# EAGLE design PCB (EAGLE 9.6.2)
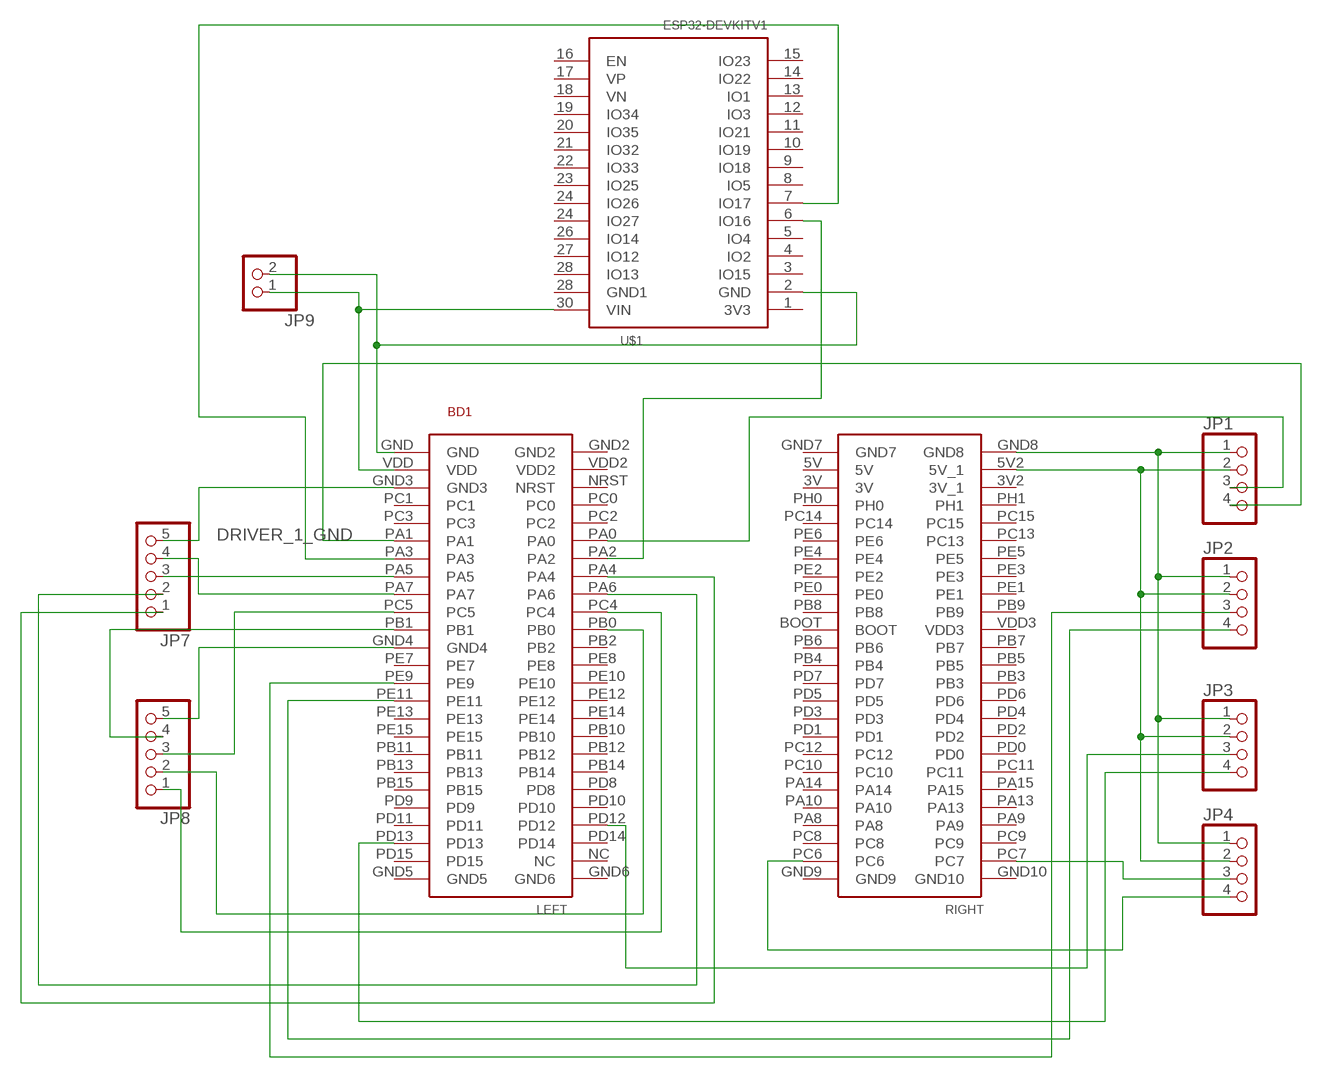
[diagram p0: schematic, sheet 1]

## Parts
BD1  STM32F4-DISCOVERY  [STM32F407VG]
JP1  PINHD-1X4  [1X04]
JP2  PINHD-1X4  [1X04]
JP3  PINHD-1X4  [1X04]
JP4  PINHD-1X4  [1X04]
JP7  PINHD-1X5  [1X05]
JP8  PINHD-1X5  [1X05]
JP9  PINHD-1X2  [1X02]
U$1  ESP32DEVKITV1  [ESP32-DEVKITV1]

## Nets
DRIVER_1_GND: BD1.GND3 JP7.5
N$1: BD1.VDD JP9.1 U$1.30(VIN)
N$2: BD1.GND JP9.2 U$1.2(GND)
N$3: BD1.GND4 JP8.5
N$4: BD1.PA7 JP7.4
N$5: BD1.PA5 JP7.3
N$6: BD1.PA6 JP7.2
N$7: BD1.PA4 JP7.1
N$8: BD1.PB1 JP8.4
N$9: BD1.PC5 JP8.3
N$10: BD1.PB0 JP8.2
N$11: BD1.PC4 JP8.1
N$12: BD1.PA2 U$1.6(IO16)
N$13: BD1.PA3 U$1.7(IO17)
N$14: BD1.GND8 JP1.1 JP2.1 JP3.1 JP4.1
N$15: BD1.5V2(5V_1) JP1.2 JP2.2 JP3.2 JP4.2
N$16: BD1.PA1 JP1.4
N$17: BD1.PA0 JP1.3
N$18: BD1.PE9 JP2.3
N$19: BD1.PE11 JP2.4
N$20: BD1.PD12 JP3.3
N$21: BD1.PD13 JP3.4
N$22: BD1.PC7 JP4.3
N$23: BD1.PC6 JP4.4
Unconnected: BD1.3V BD1.3V2(3V_1) BD1.5V BD1.BOOT BD1.GND2 BD1.GND5 BD1.GND6 BD1.GND7 BD1.GND9 BD1.GND10 BD1.NC BD1.NRST BD1.PA8 BD1.PA9 BD1.PA10 BD1.PA13 BD1.PA14 BD1.PA15 BD1.PB2 BD1.PB3 BD1.PB4 BD1.PB5 BD1.PB6 BD1.PB7 BD1.PB8 BD1.PB9 BD1.PB10 BD1.PB11 BD1.PB12 BD1.PB13 BD1.PB14 BD1.PB15 BD1.PC0 BD1.PC1 BD1.PC2 BD1.PC3 BD1.PC8 BD1.PC9 BD1.PC10 BD1.PC11 BD1.PC12 BD1.PC13 BD1.PC14 BD1.PC15 BD1.PD0 BD1.PD1 BD1.PD2 BD1.PD3 BD1.PD4 BD1.PD5 BD1.PD6 BD1.PD7 BD1.PD8 BD1.PD9 BD1.PD10 BD1.PD11 BD1.PD14 BD1.PD15 BD1.PE0 BD1.PE1 BD1.PE2 BD1.PE3 BD1.PE4 BD1.PE5 BD1.PE6 BD1.PE7 BD1.PE8 BD1.PE10 BD1.PE12 BD1.PE13 BD1.PE14 BD1.PE15 BD1.PH0 BD1.PH1 BD1.VDD2 BD1.VDD3 U$1.1(3V3) U$1.3(IO15) U$1.4(IO2) U$1.5(IO4) U$1.8(IO5) U$1.9(IO18) U$1.10(IO19) U$1.11(IO21) U$1.12(IO3) U$1.13(IO1) U$1.14(IO22) U$1.15(IO23) U$1.16(EN) U$1.17(VP) U$1.18(VN) U$1.19(IO34) U$1.20(IO35) U$1.21(IO32) U$1.22(IO33) U$1.23(IO25) U$1.24(IO26) U$1.24(IO27) U$1.26(IO14) U$1.27(IO12) U$1.28(GND1) U$1.28(IO13)

## Library data of the parts
BD1 = STM32F4 DISCOVERY:STM32F4-DISCOVERY: STM32F4DISCOVERY STM32F407VG Create by Jairo Reyes Email: jairo.314@hotmail.com
JP1-JP4 = pinhead:PINHD-1X4: PIN HEADER
JP7 JP8 = pinhead:PINHD-1X5: PIN HEADER
JP9 = pinhead:PINHD-1X2: PIN HEADER
U$1 = ESP32-DEVKITV1:ESP32DEVKITV1

## Board
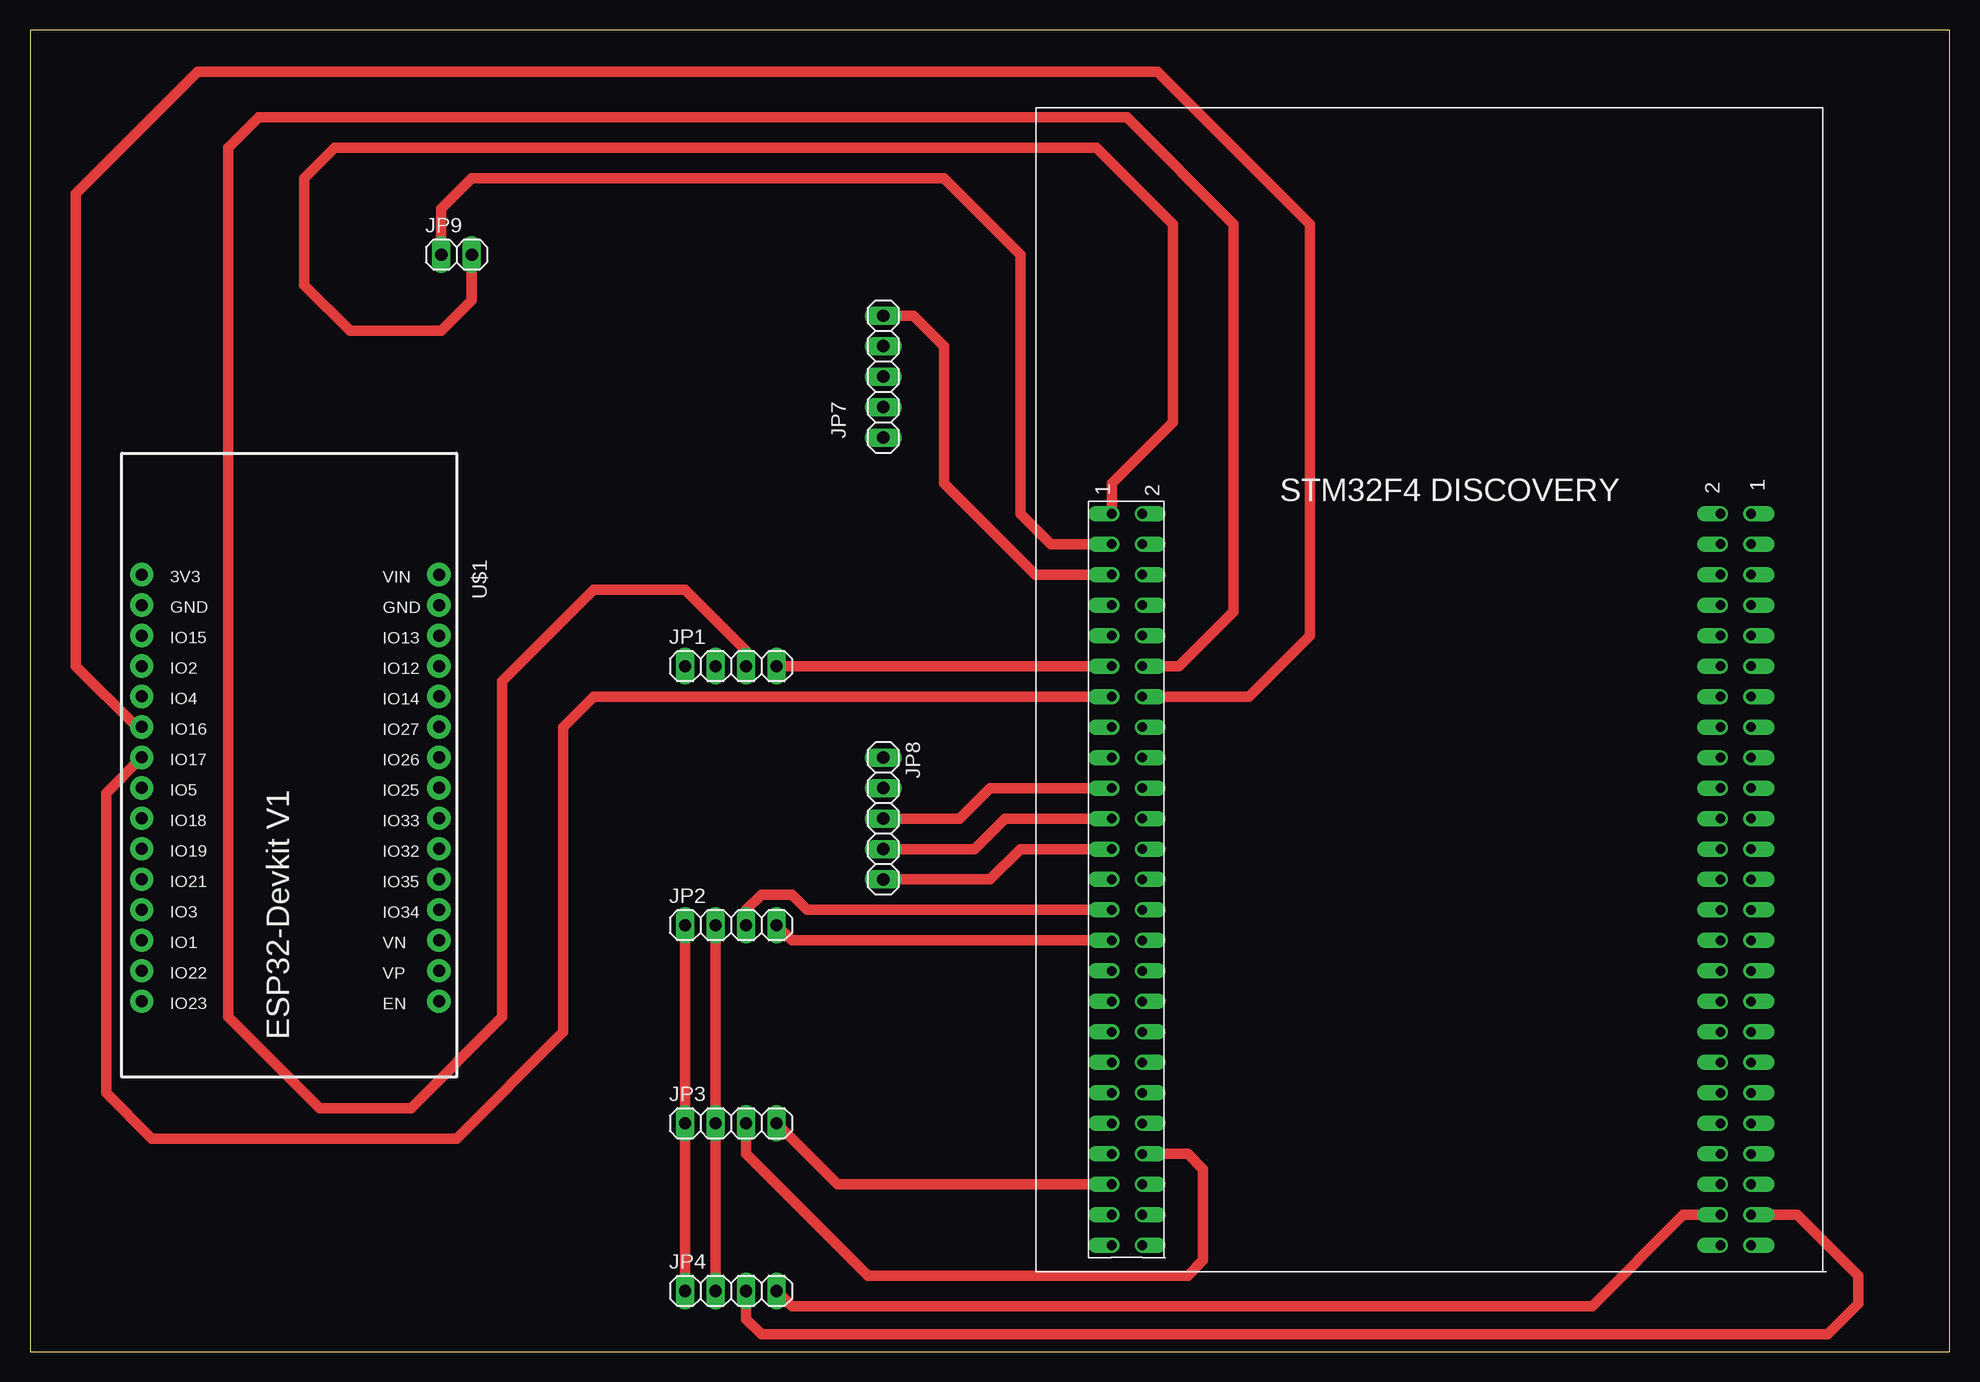
[diagram p1: board, top side]
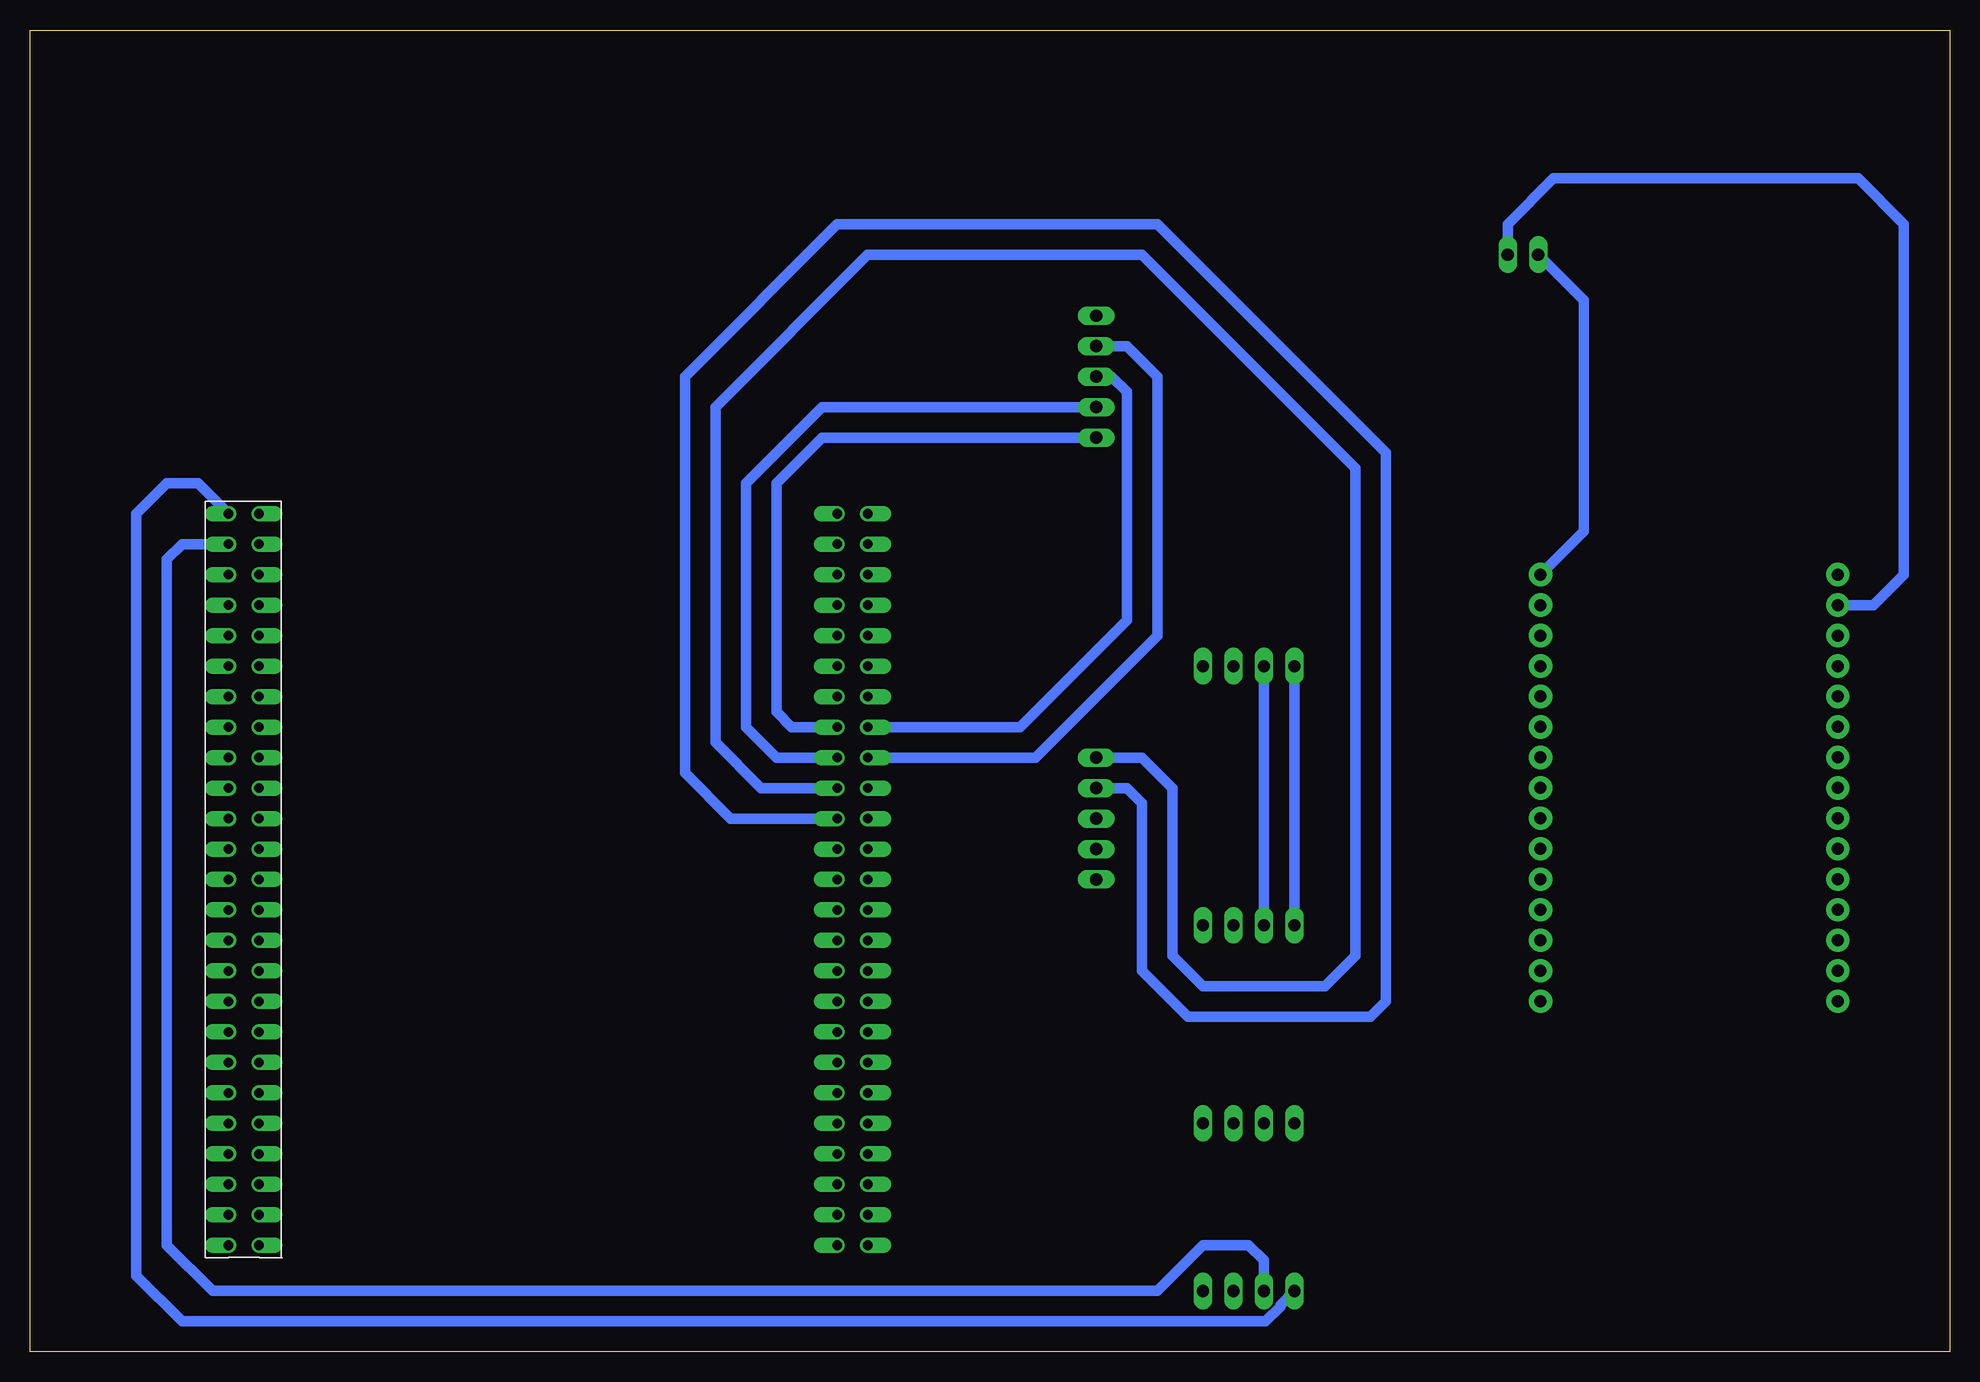
[diagram p2: board, bottom side, seen from below]

Size 160 x 110.16 mm. Coordinates in mm from the lower left corner, seen from the top.
Outline: 0,0 160,0 160,110.16 0,110.16 0,0
Copper layers (1*16): Top 0.035mm / dielectric 1.5mm / Bottom 0.035mm
Design rules "default": minimum track width 6mil, minimum drill 0.35mm, track to track 6mil, track to pad 6mil, pad to pad 6mil, via to via 6mil, smd to smd 6mil, copper to edge 40mil, drill to drill 6mil, minimum pad ring 10mil, minimum via ring 8mil, stop-mask expansion 4mil, vias tented up to drill 0mil, thermal gap 10mil

### Footprints (pad centres in the part's own frame; a part is rotated, then mirrored left to right if it is on the bottom)
STM32F407VG = drill 0.8 pad 1.27 offset: 3V 50.74,55.88; 3V2 53.28,55.88; 5V 50.74,58.42; 5V2 53.28,58.42; BOOT 50.74,35.56; GND 0,60.96; GND2 2.54,60.96; GND3 0,55.88; GND4 0,33.02; GND5 0,0; GND6 2.54,0; GND7 50.74,60.96; GND8 53.28,60.96; GND9 50.74,0; GND10 53.28,0; NC 2.54,2.54; NRST 2.54,55.88; PA0 2.54,48.26; PA1 0,48.26; PA2 2.54,45.72; PA3 0,45.72; PA4 2.54,43.18; PA5 0,43.18; PA6 2.54,40.64; PA7 0,40.64; PA8 50.74,7.62; PA9 53.28,7.62; PA10 50.74,10.16; PA13 53.28,10.16; PA14 50.74,12.7; PA15 53.28,12.7; PB0 2.54,35.56; PB1 0,35.56; PB2 2.54,33.02; PB3 53.28,27.94; PB4 50.74,30.48; PB5 53.28,30.48; PB6 50.74,33.02; PB7 53.28,33.02; PB8 50.74,38.1; PB9 53.28,38.1; PB10 2.54,20.32; PB11 0,17.78; PB12 2.54,17.78; PB13 0,15.24; PB14 2.54,15.24; PB15 0,12.7; PC0 2.54,53.34; PC1 0,53.34; PC2 2.54,50.8; PC3 0,50.8; PC4 2.54,38.1; PC5 0,38.1; PC6 50.74,2.54; PC7 53.28,2.54; PC8 50.74,5.08; PC9 53.28,5.08; PC10 50.74,15.24; PC11 53.28,15.24; PC12 50.74,17.78; PC13 53.28,48.26; PC14 50.74,50.8; PC15 53.28,50.8; PD0 53.28,17.78; PD1 50.74,20.32; PD2 53.28,20.32; PD3 50.74,22.86; PD4 53.28,22.86; PD5 50.74,25.4; PD6 53.28,25.4; PD7 50.74,27.94; PD8 2.54,12.7; PD9 0,10.16; PD10 2.54,10.16; PD11 0,7.62; PD12 2.54,7.62; PD13 0,5.08; PD14 2.54,5.08; PD15 0,2.54; PE0 50.74,40.64; PE1 53.28,40.64; PE2 50.74,43.18; PE3 53.28,43.18; PE4 50.74,45.72; PE5 53.28,45.72; PE6 50.74,48.26; PE7 0,30.48; PE8 2.54,30.48; PE9 0,27.94; PE10 2.54,27.94; PE11 0,25.4; PE12 2.54,25.4; PE13 0,22.86; PE14 2.54,22.86; PE15 0,20.32; PH0 50.74,53.34; PH1 53.28,53.34; VDD 0,58.42; VDD2 2.54,58.42; VDD3 53.28,35.56
1X04 = drill 1.016 long: 1 -3.81,0; 2 -1.27,0; 3 1.27,0; 4 3.81,0
1X05 = drill 1.016 long: 1 -5.08,0; 2 -2.54,0; 3 0,0; 4 2.54,0; 5 5.08,0
1X02 = drill 1.016 long: 1 -1.27,0; 2 1.27,0
ESP32-DEVKITV1 = drill 1 pad 1.93: 1 -22.87,-13.54; 2 -20.33,-13.54; 3 -17.79,-13.54; 4 -15.25,-13.54; 5 -12.71,-13.54; 6 -10.17,-13.54; 7 -7.63,-13.54; 8 -5.09,-13.54; 9 -2.55,-13.54; 10 -0.01,-13.54; 11 2.53,-13.54; 12 5.07,-13.54; 13 7.61,-13.54; 14 10.15,-13.54; 15 12.69,-13.54; 16 12.69,11.23; 17 10.15,11.23; 18 7.61,11.23; 19 5.07,11.23; 20 2.53,11.23; 21 -0.01,11.23; 22 -2.55,11.23; 23 -5.09,11.23; 24 -7.63,11.23; 25 -10.17,11.23; 26 -12.71,11.23; 27 -15.25,11.23; 28 -17.79,11.23; 29 -20.33,11.23; 30 -22.87,11.23

### Placement (x,y rotation side)
BD1  90.17,8.89 0 top
JP1  58.42,57.15 0 top
JP2  58.42,35.56 0 top
JP3  58.42,19.05 0 top
JP4  58.42,5.08 0 top
JP7  71.12,81.28 90 top
JP8  71.12,44.45 270 top
JP9  35.56,91.44 0 top
U$1  22.86,41.91 270 top

### Tracks (layer width: path | path; a pad name or v marks a point on that pad's centre or on a via)
DRIVER_1_GND
  Top 0.889: BD1.GND3 83.82,64.77 76.2,72.39 76.2,83.82 73.66,86.36 JP7.5
N$1
  Top 0.889: BD1.VDD 85.09,67.31 82.55,69.85 82.55,91.44 76.2,97.79 36.83,97.79 34.29,95.25 JP9.1
  Bottom 0.889: JP9.1 30.48,87.63 30.48,68.39 U$1.30
N$2
  Top 0.889: BD1.GND 90.17,72.39 95.25,77.47 95.25,93.98 88.9,100.33 25.4,100.33 22.86,97.79 22.86,88.9 26.67,85.09 34.29,85.09 36.83,87.63 JP9.2
  Bottom 0.889: JP9.2 36.83,93.98 33.02,97.79 7.62,97.79 3.81,93.98 3.81,64.77 6.34,62.24 U$1.2
N$3
  Top 0.889: JP8.5 80.01,39.37 82.55,41.91 BD1.GND4
N$4
  Bottom 0.889: BD1.PA7 76.2,49.53 66.04,59.69 66.04,81.28 68.58,83.82 JP7.4
N$5
  Bottom 0.889: BD1.PA5 77.47,52.07 68.58,60.96 68.58,80.01 69.85,81.28 JP7.3
N$6
  Bottom 0.889: BD1.PA6 97.79,49.53 100.33,52.07 100.33,72.39 93.98,78.74 JP7.2
N$7
  Bottom 0.889: BD1.PA4 96.52,52.07 97.79,53.34 97.79,72.39 93.98,76.2 JP7.1
N$8
  Top 0.889: BD1.PB1 81.28,44.45 78.74,41.91 JP8.4
N$9
  Top 0.889: BD1.PC5 80.01,46.99 77.47,44.45 JP8.3
N$10
  Bottom 0.889: BD1.PB0 101.6,44.45 105.41,48.26 105.41,81.28 92.71,93.98 66.04,93.98 46.99,74.93 46.99,29.21 48.26,27.94 63.5,27.94 67.31,31.75 67.31,45.72 68.58,46.99 JP8.2
N$11
  Bottom 0.889: BD1.PC4 99.06,46.99 102.87,50.8 102.87,78.74 90.17,91.44 67.31,91.44 49.53,73.66 49.53,33.02 52.07,30.48 62.23,30.48 64.77,33.02 64.77,46.99 67.31,49.53 JP8.1
N$12
  Top 0.889: BD1.PA2 101.6,54.61 106.68,59.69 106.68,93.98 93.98,106.68 13.97,106.68 3.81,96.52 3.81,57.15 8.88,52.08 U$1.6
N$13
  Top 0.889: BD1.PA3 46.99,54.61 44.45,52.07 44.45,26.67 35.56,17.78 10.16,17.78 6.35,21.59 6.35,46.57 U$1.7
N$14
  Top 0.889: JP4.1 JP3.1 JP2.1
  Bottom 0.889: JP2.1 JP1.1 | BD1.GND8 145.99,72.39 148.59,72.39 151.13,69.85 151.13,6.35 147.32,2.54 57.01,2.54 55.79,3.75 55.79,3.9 JP4.1
N$15
  Top 0.889: JP4.2 JP3.2 JP2.2
  Bottom 0.889: JP2.2 JP1.2 | BD1.5V2 147.32,67.31 148.59,66.04 148.59,8.89 144.78,5.08 66.04,5.08 62.23,8.89 58.42,8.89 57.15,7.62 JP4.2
N$16
  Top 0.889: BD1.PA1 JP1.4
N$17
  Top 0.889: BD1.PA0 95.79,57.15 100.33,61.69 100.33,93.98 91.44,102.87 19.05,102.87 16.51,100.33 16.51,27.94 24.13,20.32 31.75,20.32 39.37,27.94 39.37,55.88 46.99,63.5 54.61,63.5 59.69,58.42 JP1.3
N$18
  Top 0.889: BD1.PE9 64.77,36.83 63.5,38.1 60.96,38.1 59.69,36.83 JP2.3
N$19
  Top 0.889: JP2.4 63.5,34.29 BD1.PE11
N$20
  Top 0.889: BD1.PD12 96.52,16.51 97.79,15.24 97.79,7.62 96.52,6.35 69.85,6.35 59.69,16.51 JP3.3
N$21
  Top 0.889: BD1.PD13 67.31,13.97 JP3.4
N$22
  Top 0.889: BD1.PC7 147.32,11.43 152.4,6.35 152.4,4 149.86,1.46 60.96,1.46 59.69,2.73 JP4.3
N$23
  Top 0.889: BD1.PC6 137.83,11.43 130.21,3.81 63.5,3.81 JP4.4